# EAGLE design Shield_DMM (EAGLE 6.4)
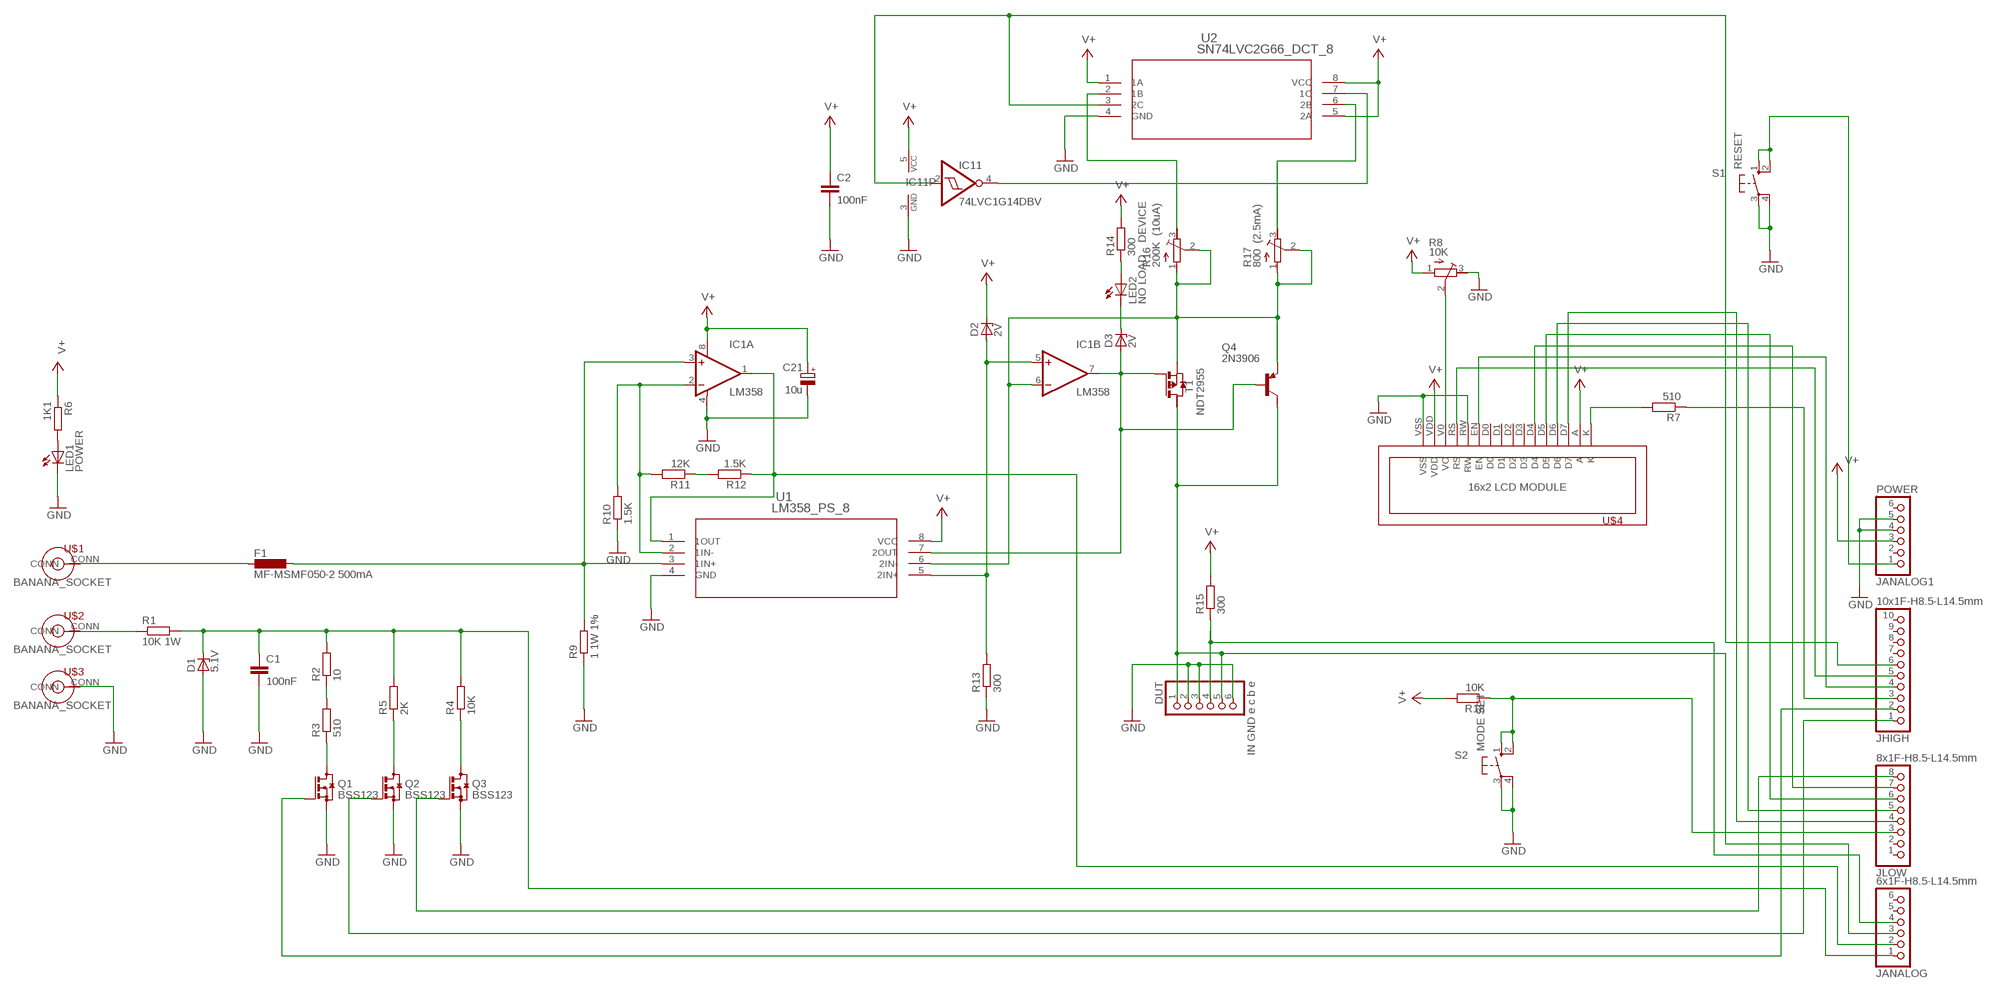
[diagram p0: schematic, sheet 1]

## Parts
C1  100nF  C-EUC0805  [C0805]
C2  100nF  C-EUC0805  [C0805]
C21  10u  CPOL-EU085CS-1AR  [085CS_1AR]
D1  5.1V  BZV10  [DO34Z7]
D2  2V  BZV10  [DO34Z7]
D3  2V  BZV10  [DO34Z7]
DUT  IN GND e c b e  PINHD-1X6  [1X06]
F1  MF-MSMF050-2 500mA  L-EUL1812  [L1812]
IC1  LM358  OPA2340U  [SO08]
IC11  74LVC1G14DBV  [SOT23-5]
JANALOG  6x1F-H8.5-L14.5mm  PINHD-1X6  [1X06]
JANALOG1  POWER  PINHD-1X6  [1X06]
JHIGH  10x1F-H8.5-L14.5mm  PINHD-1X10  [1X10]
JLOW  8x1F-H8.5-L14.5mm  PINHD-1X8  [1X08]
LED1  POWER  LEDCHIPLED_0805  [CHIPLED_0805]
LED2  NO LOAD DEVICE  LEDCHIPLED_0805  [CHIPLED_0805]
Q1  BSS123  [SOT23]
Q2  BSS123  [SOT23]
Q3  BSS123  [SOT23]
Q4  2N3906  [TO92]
R1  10K 1W  R-EU_0207/10  [0207/10]
R2  10  R-EU_R0805  [R0805]
R3  510  R-EU_R0805  [R0805]
R4  10K  R-EU_R0805  [R0805]
R5  2K  R-EU_R0805  [R0805]
R6  1K1  R-EU_R0805  [R0805]
R7  510  R-EU_R0805  [R0805]
R8  10K  R-TRIMM64W  [RTRIM64W]
R9  1 1W 1%  R-EU_0207/10  [0207/10]
R10  1.5K  R-EU_R0805  [R0805]
R11  12K  R-EU_R0805  [R0805]
R12  1.5K  R-EU_R0805  [R0805]
R13  300  R-EU_R0805  [R0805]
R14  300  R-EU_R0805  [R0805]
R15  300  R-EU_R0805  [R0805]
R16  200K (10uA)  R-TRIMM64W  [RTRIM64W]
R17  800 (2.5mA)  R-TRIMM64W  [RTRIM64W]
R18  10K  R-EU_R0805  [R0805]
S1  RESET  10-XX  [B3F-10XX]
S2  MODE SET  10-XX  [B3F-10XX]
T1  NDT2955  PMOSSOT223  [SOT223]
U1  LM358_PS_8  [PS8]
U2  SN74LVC2G66_DCT_8  [DCT8]
U$1  BANANA_CONN  [BANANA_CONN]
U$2  BANANA_CONN  [BANANA_CONN]
U$3  BANANA_CONN  [BANANA_CONN]
U$4  1602_LCM  [1602_LCM]

## Nets
GND: C1.2 C2.2 C21.- D1.A DUT.2 DUT.3 DUT.6 IC1.4(A:V-) IC11.3(GND) JANALOG1.4 JANALOG1.5 LED1.C Q1.2(S) Q2.2(S) Q3.2(S) R8.3(E) R9.1 R10.1 R13.1 S1.3(P) S1.4(P1) S2.3(P) S2.4(P1) U1.4(GND) U2.4(GND) U$3.CONN U$4.RW U$4.VSS
N$1: R1.1 U$2.CONN
N$2: C1.1 D1.C JANALOG.1 R1.2 R2.2 R4.2 R5.2
N$3: JHIGH.1 Q2.1(G)
N$4: Q3.3(D) R4.1
N$5: R2.1 R3.2
N$6: Q1.3(D) R3.1
N$7: JHIGH.2 Q1.1(G)
N$8: JLOW.8 Q3.1(G)
N$9: Q2.3(D) R5.1
N$10: LED1.A R6.2
N$11: R7.2 U$4.K
N$12: JHIGH.3 R7.1
N$13: R8.2(S) U$4.V0(VO)
N$14: JHIGH.4 U$4.EN
N$15: JHIGH.5 U$4.RS
N$16: JLOW.7 U$4.D4
N$17: JLOW.6 U$4.D5
N$18: JLOW.4 U$4.D7
N$19: JLOW.3 R18.1 S2.1(S) S2.2(S1)
N$20: F1.2 U$1.CONN
N$21: F1.1 IC1.3(A:+IN) R9.2 U1.3(1IN+)
N$22: IC1.2(A:-IN) R10.2 R11.2 U1.2(1IN-)
N$23: D2.A IC1.5(B:+IN) R13.2 U1.5(2IN+)
N$24: R11.1 R12.2
N$25: IC1.1(A:OUT) JANALOG.2 R12.1 U1.1(1OUT)
N$27: IC1.6(B:-IN) Q4.3(E) R16.1(A) R16.2(S) R17.1(A) R17.2(S) T1.3(S) U1.6(2IN-)
N$28: D3.C LED2.C
N$29: LED2.A R14.1
N$30: DUT.1 DUT.5 JANALOG.3 Q4.1(C) T1.2(D)
N$31: JANALOG1.1 S1.1(S) S1.2(S1)
N$32: DUT.4 JANALOG.4 R15.1
N$33: JLOW.5 U$4.D6
N$34: IC11.2(I) JHIGH.6 U2.3(2C)
N$35: R16.3(E) U2.2(1B)
N$36: IC11.4(O) U2.7(1C)
N$38: D3.A IC1.7(B:OUT) Q4.2(B) T1.1(G) U1.7(2OUT)
N$39: R17.3(E) U2.6(2B)
V+: C2.1 C21.+ D2.C IC1.8(A:V+) IC11.5(VCC) JANALOG1.3 R6.1 R8.1(A) R14.2 R15.2 R18.2 U1.8(VCC) U2.1(1A) U2.5(2A) U2.8(VCC) U$4.A U$4.VDD
Unconnected: JANALOG1.2 JANALOG1.6 JANALOG.5 JANALOG.6 JHIGH.7 JHIGH.8 JHIGH.9 JHIGH.10 JLOW.1 JLOW.2 T1.4(D2) U$4.D0 U$4.D1 U$4.D2 U$4.D3

## Library data of the parts
C1 C2 = rcl:C-EU: CAPACITOR, European symbol
C21 = rcl:CPOL-EU: POLARIZED CAPACITOR, European symbol
D1-D3 = diode:BZV10: Z DIODE
DUT JANALOG JANALOG1 = pinhead:PINHD-1X6: PIN HEADER
F1 = rcl:L-EU: INDUCTOR, European symbol
IC1 = burr-brown:OPA2340: Single-Supply, Rail-to-Rail Operational Amplifiers MicroAmplifier(TM) Series; Product Folder:OPA2340; MF: TEXAS INSTRUMENTS; MPN: OPA2340UA; OC_FARNELL: 1101541; OC_NEWARK: 36K7581
IC11 = 74xx-little-de:74*1G14: Single Schmitt-Trigger Inverter Gate
JHIGH = SmartPrj:PINHD-1X10: PIN HEADER
JLOW = SmartPrj:PINHD-1X8: PIN HEADER
LED1 LED2 = led:LED: LED OSRAM: - CHIPLED LG R971, LG N971, LY N971, LG Q971, LY Q971, LO R971, LY R971 LH N974, LH R974 LS Q976, LO Q976, LY Q976 LO Q996 - Hyper CHIPLED LW Q18S LB Q993, LB Q99A, LB R99A - SideLED LS A670, LO A670, LY A670, LG A670, LP A670 LB A673, LV A673, LT A673, LW A673 LH A674 LY A675 LS A676, LA A676, LO A676, LY A676, LW A676 LS A679, LY A679, LG A679 - Hyper Micro SIDELED® LS Y876, LA Y876, LO Y876, LY Y876 LT Y87S - SmartLED LW L88C, LW L88S LB L89C, LB L89S, LG L890 LS L89K, LO L89K, LY L89K LS L896, LA L896, LO L896, LY L896 - TOPLED LS T670, LO T670, LY T670, LG T670, LP T670 LSG T670, LSP T670, LSY T670, LOP T670, LYG T670 LG T671, LOG T671, LSG T671 LB T673, LV T673, LT T673, LW T673 LH T674 LS T676, LA T676, LO T676, LY T676, LB T676, LH T676, LSB T676, LW T676 LB T67C, LV T67C, LT T67C, LS T67K, LO T67K, LY T67K, LW E67C LS E67B, LA E67B, LO E67B, LY E67B, LB E67C, LV E67C, LT E67C LW T67C LS T679, LY T679, LG T679 LS T770, LO T770, LY T770, LG T770, LP T770 LB T773, LV T773, LT T773, LW T773 LH T774 LS E675, LA E675, LY E675, LS T675 LS T776, LA T776, LO T776, LY T776, LB T776 LHGB T686 LT T68C, LB T68C - Hyper Mini TOPLED® LB M676 - Mini TOPLED Santana® LG M470 LS M47K, LO M47K, LY M47K Source: http://www.osram.convergy.de LUXEON: - LUMILED® LXK2-PW12-R00, LXK2-PW12-S00, LXK2-PW14-U00, LXK2-PW14-V00 LXK2-PM12-R00, LXK2-PM12-S00, LXK2-PM14-U00 LXK2-PE12-Q00, LXK2-PE12-R00, LXK2-PE12-S00, LXK2-PE14-T00, LXK2-PE14-U00 LXK2-PB12-K00, LXK2-PB12-L00, LXK2-PB12-M00, LXK2-PB14-N00, LXK2-PB14-P00, LXK2-PB14-Q00 LXK2-PR12-L00, LXK2-PR12-M00, LXK2-PR14-Q00, LXK2-PR14-R00 LXK2-PD12-Q00, LXK2-PD12-R00, LXK2-PD12-S00 LXK2-PH12-R00, LXK2-PH12-S00 LXK2-PL12-P00, LXK2-PL12-Q00, LXK2-PL12-R00 Source: www.luxeon.com KINGBRIGHT: KA-3528ASYC Source: www.kingbright.com
Q1-Q3 = transistor-small-signal:BSS123: N-CHANNEL MOS FET
Q4 = transistor-pnp:2N3906: PNP Transistor
R1-R7 R9-R15 R18 = rcl:R-EU_: RESISTOR, European symbol
R8 R16 R17 = rcl:R-TRIMM: Trimm resistor
S1 S2 = switch-omron:10-XX: OMRON SWITCH
T1 = zetex:PMOSSOT223: MOS FET
U1 = LM358PS:LM358_PS_8; DATASHEETURL: http://www.ti.com/lit/gpn/LM358; DESCRIPTION: Dual Operational Amplifiers; FAMILY_NAME: STANDARD LINEAR AMPLIFIER; GENERIC_PART_NUMBER: LM358; INDUSTRY_STD_PKG_TYPE: SO; MANUFACTURER: Texas Instruments; PACKAGE_DESIGNATOR: PS; PIN_COUNT: 8
U2 = SN74LVC2G66_DCT_8:SN74LVC2G66_DCT_8; DATASHEETURL: http://www.ti.com/lit/gpn/SN74LVC2G66; DESCRIPTION: Dual Analog Switch; FAMILY_NAME: ANALOG SWITCH/MULTIPLEXER(less than or equal to 5V); GENERIC_PART_NUMBER: SN74LVC2G66; INDUSTRY_STD_PKG_TYPE: SM8; MANUFACTURER: Texas Instruments; MANUFACTURER_PART_NUMBER: sn74lvc2g66_dct_8; PACKAGE_DESIGNATOR: DCT; PIN_COUNT: 8; VENDOR: Texas Instruments
U$1-U$3 = banana-socket:BANANA_CONN: BANANA SOCKET 3.5 mm.
U$4 = 1602-LCM:1602_LCM

## Net classes
0 default: width 0.152 mm, drill 0.61 mm, clearance 0.152 mm
1 power: width 0.152 mm, drill 0.61 mm, clearance 0.152 mm
2 VIN: width 0.305 mm, drill 0.61 mm, clearance 0.152 mm
3 usbvcc: width 0.508 mm, drill 0.61 mm, clearance 0.254 mm

## Board
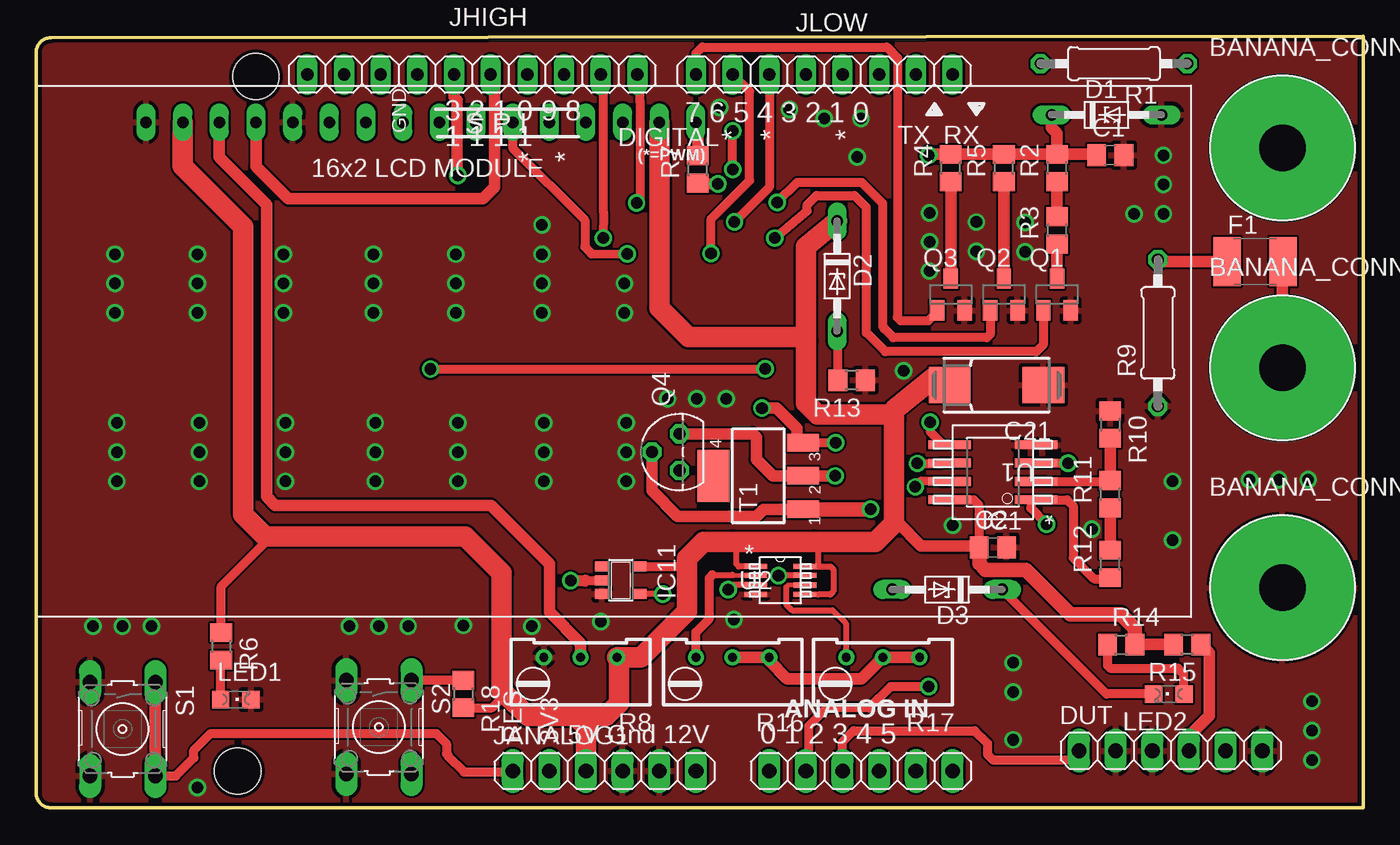
[diagram p1: board, top side]
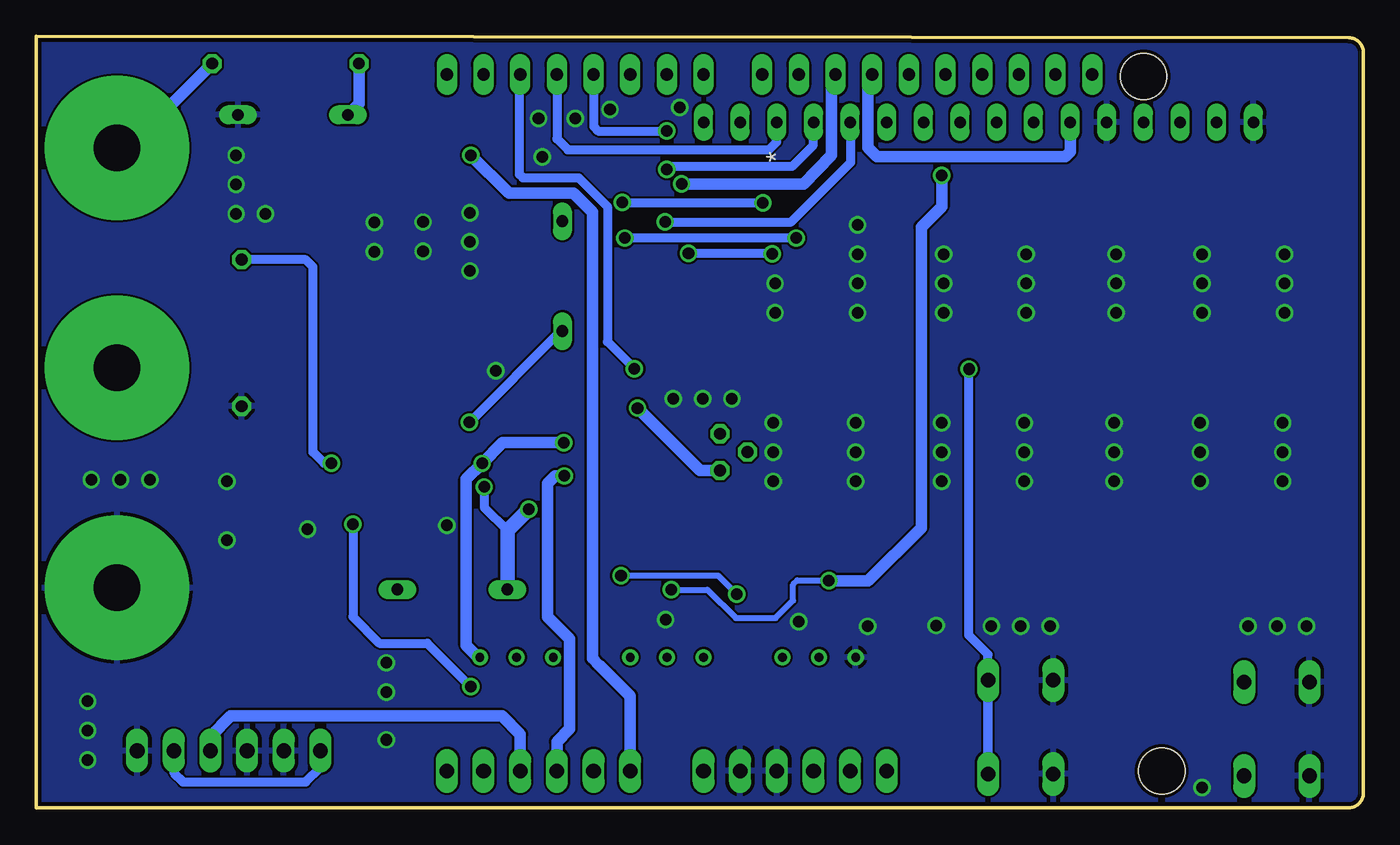
[diagram p2: board, bottom side, seen from below]

Size 91.96 x 53.48 mm. Coordinates in mm from the lower left corner, seen from the top.
Outline: 91.95,0 91.95,53.48 1,53.36 arc90 0,52.36 0,1.02 arc90 1,0.02 91.96,0.02
Copper layers (1*16): Top 0.035mm / dielectric 1.5mm / Bottom 0.035mm
Design rules "ITEADstudio_DRC": minimum track width 6mil, minimum drill 12mil, track to track 6mil, track to pad 6mil, pad to pad 6mil, via to via 6mil, smd to smd 0mil, copper to edge 10mil, drill to drill 10mil, minimum pad ring 10mil, minimum via ring 6mil, stop-mask expansion 2mil, vias tented up to drill 100mil, thermal gap 10mil
Holes 3.2 mm at 15.24,50.69 13.97,2.56

### Footprints (pad centres in the part's own frame; a part is rotated, then mirrored left to right if it is on the bottom)
C0805 = smd 1.3 x 1.5: 1 -0.95,0; 2 0.95,0
085CS_1AR = smd 2.9 x 2.5: + 3.25,0; - -3.25,0
DO34Z7 = drill 0.813 long: A 3.81,0; C -3.81,0
1X06 = drill 1.016 long: 1 -6.35,0; 2 -3.81,0; 3 -1.27,0; 4 1.27,0; 5 3.81,0; 6 6.35,0
L1812 = smd 1.9 x 3.4: 1 -1.95,0; 2 1.95,0
SO08 = smd 0.61 x 2.21: 1 -1.905,-2.616; 2 -0.635,-2.616; 3 0.635,-2.616; 4 1.905,-2.616; 5 1.905,2.616; 6 0.635,2.616; 7 -0.635,2.616; 8 -1.905,2.616
SOT23-5 = smd 0.69 x 0.99: 1 -0.95,-1.29; 2 0,-1.29; 3 0.95,-1.29; 4 0.95,1.3; 5 -0.95,1.3
1X10 = drill 0.85 pad 1.422 long: 1 -11.43,0; 2 -8.89,0; 3 -6.35,0; 4 -3.81,0; 5 -1.27,0; 6 1.27,0; 7 3.81,0; 8 6.35,0; 9 8.89,0; 10 11.43,0
1X08 = drill 0.85 pad 1.422 long: 1 -8.89,0; 2 -6.35,0; 3 -3.81,0; 4 -1.27,0; 5 1.27,0; 6 3.81,0; 7 6.35,0; 8 8.89,0
CHIPLED_0805 = smd 1.2 x 1.2: A 0,-1.05; C 0,1.05
SOT23 = smd 1 x 1.4: 1 -0.95,-1.1; 2 0.95,-1.1; 3 0,1.1
TO92 = drill 0.813 octagon: 1 1.27,0; 2 0,1.905; 3 -1.27,0
0207/10 = drill 0.813 octagon: 1 -5.08,0; 2 5.08,0
R0805 = smd 1.3 x 1.5: 1 -0.95,0; 2 0.95,0
RTRIM64W = drill 0.61: 1 1.27,-2.54; 2 1.27,0; 3 1.27,2.54
B3F-10XX = drill 1.016 long: 1 -3.251,2.261; 2 3.251,2.261; 3 -3.251,-2.261; 4 3.251,-2.261
SOT223 = smd 1.219 x 2.235: 1 -2.311,-3.099; 2 0,-3.099; 3 2.311,-3.099 | smd 3.6 x 2.2: 4 0,3.099
PS8 = smd 2.057 x 0.559: 1 -3.429,1.905; 2 -3.429,0.635; 3 -3.429,-0.635; 4 -3.429,-1.905; 5 3.429,-1.905; 6 3.429,-0.635; 7 3.429,0.635; 8 3.429,1.905
DCT8 = smd 1.575 x 0.356: 1 -1.702,0.965; 2 -1.702,0.33; 3 -1.702,-0.33; 4 -1.702,-0.965; 5 1.702,-0.965; 6 1.702,-0.33; 7 1.702,0.33; 8 1.702,0.965
BANANA_CONN = drill 3.2 pad 10: CONN 0,0
1602_LCM = drill 0.8 long: A 43.18,34.29; D0 22.86,34.29; D1 25.4,34.29; D2 27.94,34.29; D3 30.48,34.29; D4 33.02,34.29; D5 35.56,34.29; D6 38.1,34.29; D7 40.64,34.29; EN 20.32,34.29; K 45.72,34.29; RS 15.24,34.29; RW 17.78,34.29; V0 12.7,34.29; VDD 10.16,34.29; VSS 7.62,34.29

### Placement (x,y rotation side)
C1  74.42,45.23 0 top
C2  66.29,18.05 0 top
C21  66.55,29.29 180 top
D1  74.17,48.02 0 top
D2  55.5,36.85 270 top
D3  63.12,15.13 180 top
DUT  78.61,3.95 0 top
F1  84.45,37.86 0 top
IC1  66.29,23.26 90 top
IC11  40.51,15.76 270 top
JANALOG  57.15,2.56 0 top
JANALOG1  39.37,2.56 0 top
JHIGH  30.23,50.82 180 top
JLOW  54.61,50.82 180 top
LED1  13.84,7.51 270 top
LED2  78.49,7.89 90 top
Q1  70.74,35.58 0 top
Q2  67.06,35.58 0 top
Q3  63.37,35.58 0 top
Q4  44.58,24.65 90 top
R1  74.68,51.58 180 top
R2  70.74,44.34 90 top
R3  70.74,40.02 90 top
R4  63.37,44.34 90 top
R5  67.06,44.34 90 top
R6  12.83,11.19 270 top
R7  45.85,44.24 90 top
R8  37.72,9.17 90 top
R9  77.72,32.91 90 top
R10  74.42,26.56 270 top
R11  74.42,21.73 90 top
R12  74.42,16.91 90 top
R13  56.52,29.63 180 top
R14  75.18,11.32 0 top
R15  79.76,11.32 180 top
R16  48.26,9.17 90 top
R17  58.67,9.17 90 top
R18  29.59,7.89 270 top
S1  6,5.47 270 top
S2  23.75,5.59 270 top
T1  50.04,23 90 top
U1  66.29,23.26 180 top
U2  51.56,15.76 0 top
U$1  86.36,30.5 0 top
U$2  86.36,45.74 0 top
U$3  86.36,15.26 0 top
U$4  0,13.22 0 top

### Tracks (layer width: path | path; a pad name or v marks a point on that pad's centre or on a via)
GND  (via drill 0.8)
  Top 0.305: IC1.4 U1.4
  other vias: 78.11,43.2 78.11,41.16 76.07,41.16 78.11,45.23 61.91,39.22 61.9,37.2 61.9,41.24 40.77,36.34 40.77,34.31 35.05,40.4 40.89,24.65 40.89,22.62 40.89,26.69 35.05,36.34 35.05,34.31 35.05,38.37 35.18,24.65 35.18,22.62 35.18,26.69 29.08,36.34 29.08,34.31 29.08,38.37 29.21,24.65 29.21,22.62 29.21,26.69 23.37,36.34 23.37,34.31 23.37,38.37 23.5,24.65 23.5,22.62 23.5,26.69 17.14,36.34 17.14,34.31 17.14,38.37 17.27,24.65 17.27,22.62 17.27,26.69 11.18,36.34 11.18,34.31 11.18,38.37 11.3,24.65 11.3,22.62 11.3,26.69 5.46,36.34 5.46,34.31 5.46,38.37 5.59,24.65 5.59,22.62 5.59,26.69 67.69,8.02 67.69,4.71 67.69,10.05 73.15,19.32 78.74,18.56 78.74,22.62 88.39,5.35 88.39,3.32 88.39,7.38 86.11,22.75 88.14,22.75 84.07,22.75 45.78,28.34 43.75,28.34 47.82,28.34 5.97,12.59 8,12.59 3.94,12.59 23.75,12.59 25.78,12.59 21.72,12.59 48.35,13.05 39.12,12.89 68.52,38.54 68.52,40.57 65.15,38.56 65.15,40.59 29.59,12.64 34.35,12.58 60.12,30.28 54.61,47.77 52.2,48.4 47.37,48.53 56.9,45.1 57.15,47.77 11.18,1.41 63.5,19.57
  pour Bottom: -1.27,54.63 93.98,54.63 93.98,-1.25 -1.27,-1.25
  pour Top: -2.54,55.9 95.25,55.9 95.25,-2.52 -2.54,-2.52
N$1
  Bottom 0.813: U$2.CONN 85.6,45.74 R1.1
N$2  (via drill 0.8)
  Top 0.813: D1.C 70.36,47.13 70.74,46.75 R2.2 | R2.2 73.41,45.29 C1.1 | R2.2 R5.2 R4.2 61.91,45.29 v61.85,45.23
  Bottom 0.813: R1.2 69.6,48.78 D1.C | JANALOG.1 50.8,7.76 52.2,9.16 52.21,9.16 52.93,9.88 52.95,9.88 53.42,10.35 53.42,41.28 54.72,42.59 59.21,42.59 v61.85,45.23
N$3  (via drill 0.8)
  Top 0.61: Q2.1 66.11,32.82 65.86,32.58 59.4,32.58 58.78,33.2 58.78,33.25 58.66,33.37 58.66,41.89 57.21,43.34 52.72,43.34 v51.35,41.96 | JHIGH.1 41.82,50.51 41.82,48.96 41.86,48.92 41.86,42.17 v41.6,41.91
  Bottom 0.61: 41.77,41.95 v41.6,41.91 41.76,41.95 51.13,41.95 v51.35,41.96
N$4
  Top 0.813: R4.1 Q3.3
N$5
  Top 0.813: R2.1 R3.2
N$6
  Top 0.813: R3.1 Q1.3
N$7  (via drill 0.8)
  Top 0.61: Q1.1 69.79,32.1 69.3,31.61 58.84,31.61 57.53,32.92 57.53,41.6 56.69,42.43 54.08,42.43 53.42,41.77 53.42,41.37 v51.18,39.49 | JHIGH.2 39.31,50.62 39.31,41.33 v39.29,39.49
  Bottom 0.61: v39.29,39.49 v51.18,39.49
N$8
  Top 0.61: Q3.1 62.42,34.36 61.8,33.73 59.92,33.73 59.65,34 59.69,34.04 59.69,51.96 58.94,52.72 46.15,52.72 45.72,52.29 JLOW.8
N$9
  Top 0.813: R5.1 Q2.3
N$10
  Top 0.61: LED1.A 12.79,10.21 R6.2
N$11
  Top 0.813: R7.2 45.85,47.39 U$4.K
N$12  (via drill 0.8)
  Top 0.813: R7.1 47.2,43.22 v47.24,43.23
  Bottom 0.813: v47.24,43.23 38.81,43.23 36.84,45.23 36.84,50.55 JHIGH.3
N$13
  Top 0.813: R8.2 37.72,11.41 35.56,13.57 35.56,16.92 31.51,20.97 16.56,20.97 15.96,21.57 15.96,41.81 12.7,45.08 U$4.V0
N$14
  Bottom 0.813: U$4.EN 20.32,45.46 20.64,45.14 33.72,45.14 34.31,45.74 34.31,50.54 JHIGH.4
N$15
  Top 0.813: U$4.RS 15.24,44.44 17.48,42.2 30.96,42.2 31.76,43.02 31.75,50.45 JHIGH.5
N$16  (via drill 0.8)
  Top 0.61: U$4.D4 33.02,45.72 38.02,40.72 38.02,38.88 38.47,38.38 v40.96,38.39 | v46.76,38.42 46.76,40.81 49.43,43.48 49.43,49.65 JLOW.7
  Bottom 0.61: v40.96,38.39 46.74,38.39 v46.76,38.42
N$17  (via drill 0.8)
  Top 0.61: JLOW.6 50.8,43.02 v48.39,40.6
  Bottom 0.61: v48.39,40.6 39.65,40.6 35.52,44.73 35.52,47.48 U$4.D5
N$18
  Bottom 0.61: JLOW.4 55.88,46.36 55.12,45.6 41.2,45.6 40.65,46.14 40.65,47.5 U$4.D7
N$19  (via drill 0.8)
  Top 0.61: R18.1 S2.1 | v27.33,30.41 50.48,30.41 v50.51,30.43
  Bottom 0.61: S2.1 S2.2 26.01,10.63 27.34,11.97 27.34,30.39 v27.33,30.41 | JLOW.3 58.47,50.77 58.47,43.91 58.23,43.67 54.37,43.67 52.38,41.67 52.38,32.3 v50.51,30.43
N$20
  Top 0.813: U$1.CONN 86.36,37.99 86.74,38.37 86.74,38.2 F1.2
N$21  (via drill 0.8)
  Top 0.61: IC1.3 U1.3 v71.5,23.89
  Top 0.813: F1.1 77.85,37.86 R9.2
  Bottom 0.61: v71.5,23.89 72.01,23.89 72.77,24.65 72.77,37.48 73.28,37.99 R9.2
N$22
  Top 0.305: IC1.2 U1.2
  Top 0.61: U1.2 74.36,22.62 R11.2
  Top 0.813: R11.2 R10.2
N$23  (via drill 0.8)
  Top 0.305: IC1.5 U1.5
  Top 0.61: v61.94,26.71 61.94,26.09 U1.5 | R13.2 55.56,32.97 D2.A
  Bottom 0.61: D2.A 55.65,33.04 55.65,33 v61.94,26.71
N$24
  Top 0.813: R12.2 R11.1
N$25  (via drill 0.8)
  Top 0.305: IC1.1 U1.1
  Top 0.61: U1.1 71.42,21.35 71.86,20.92 71.86,17.33 73.3,15.88 74.34,15.88 R12.1 | IC1.1 68.91,20.77 v70.02,19.66 | v61.85,8.4 59.2,8.4 57.72,6.92 54.8,6.92 53.53,5.66 53.53,2.75 JANALOG.2
  Bottom 0.61: v70.02,19.66 70.02,13.24 68.19,11.41 64.86,11.41 v61.85,8.4
N$27  (via drill 0.8)
  Top 0.305: IC1.6 U1.6
  Top 0.61: T1.3 55.4,25.31 v55.41,25.3 | v61.06,23.87 62.84,23.87 U1.6
  Top 0.813: R16.2 R16.1 50.8,10.18 52.03,8.94 57.18,8.94 R17.2 R17.1 | v50.29,27.7 51.31,27.7 52.7,26.3 52.7,25.75 T1.3
  Bottom 0.813: R17.1 61.33,10.44 62.17,11.27 62.17,22.77 v61.06,23.87 59.63,25.3 v55.41,25.3 | Q4.3 45.97,23.38 v50.29,27.7
N$28
  Top 0.61: LED2.C 74.17,7.89 D3.C
N$29
  Top 0.61: R14.1 74.23,9.86 74.42,9.67 79.12,9.67 79.5,9.29 79.5,7.92 LED2.A
N$30  (via drill 0.8)
  Top 0.61: JANALOG.3 55.88,4.59 56.64,5.35 65.02,5.35 65.91,4.46 65.91,3.7 66.29,3.32 71.63,3.32 DUT.1
  Top 0.813: v55.37,23 T1.2 51.05,23 49.91,24.15 49.91,25.67 49.66,25.92 Q4.1
  Bottom 0.61: DUT.5 82.42,2.43 81.79,1.79 73.28,1.79 72.26,2.81 DUT.1
  Bottom 0.813: v55.37,23 56.01,23 56.52,22.49 56.52,13.22 54.99,11.7 54.99,5.48 55.88,4.59 JANALOG.3
N$31
  Top 0.61: S1.2 9.68,2.21 10.92,3.46 10.92,3.98 12.1,5.16 27.72,5.16 28.43,4.45 28.43,3.76 28.51,3.69 28.51,3.61 29.64,2.48 32.94,2.48 JANALOG1.1
  Top 0.813: S1.1 S1.2
N$32
  Top 0.813: DUT.4 79.88,4.97 81.28,6.37 81.28,10.74 R15.1
  Bottom 0.813: JANALOG.4 58.42,5.1 59.69,6.37 78.49,6.37 79.88,4.97 DUT.4
N$33  (via drill 0.8)
  Top 0.61: v48.26,44.25 v48.26,46.9
  Bottom 0.61: JLOW.5 53.34,47.22 53.02,46.9 v48.26,46.9 | U$4.D6 38.11,47.5 38.11,45.93 39.6,44.44 48.07,44.44 v48.26,44.25
N$34  (via drill 0.8)
  Top 0.406: U2.3 48.27,15.43 v47.95,15.12
  Top 0.61: 38.06,15.75 39.21,15.75 IC11.2
  Top 0.813: JHIGH.6 28.96,49.27 29.17,49.05 29.17,43.86 v29.21,43.82 | v37.03,15.75 38.05,15.74 38.06,15.75
  Bottom 0.406: v47.95,15.12 45.45,15.12 43.48,13.15 40.73,13.15 39.51,14.37 39.51,15.48 IC11.2 37.05,15.76 v37.03,15.75
  Bottom 0.813: v29.21,43.82 29.21,41.67 30.63,40.25 30.63,19.41 34.31,15.73 36.56,15.73 v37.03,15.75
N$35
  Top 0.305: 48.27,16.11 49.28,16.11 49.31,16.07 49.84,16.07 U2.2
  Top 0.406: 46.86,16.14 48.23,16.14 48.27,16.11
  Top 0.61: R16.3 45.72,12.17 46.65,13.1 46.65,15.93 46.86,16.14
N$36  (via drill 0.8)
  Top 0.406: U2.7 v51.44,16.09 | v43.42,14.81 IC11.4
  Bottom 0.406: v51.44,16.09 44.7,16.09 v43.42,14.81
N$38  (via drill 0.8)
  Top 0.305: U1.7 IC1.7
  Top 0.61: U1.7 61.32,22.63 v60.92,22.24
  Top 0.813: T1.1 50.39,20.69 49.91,20.21 44.45,20.21 42.67,21.99 Q4.2
  Top 1.016: v57.84,20.69 T1.1
  Bottom 0.61: v60.92,22.24 60.92,20.82 59.31,19.22
  Bottom 1.016: D3.A 59.31,19.22 v57.84,20.69
N$39
  Top 0.305: U2.6 52.11,15.43 51.96,15.28
  Top 0.406: 51.96,15.28 51.96,14.11 52.38,13.69 55.17,13.69 56.1,12.77 56.1,10.47 R17.3
V+
  Top 0.305: 54.2,14.79 53.28,14.79 U2.5 | U2.8 54.18,16.73 54.22,16.77 | 62.22,29.84 62.17,29.62 59.45,26.9
  Top 0.406: U2.1 48.69,16.73 48.51,16.91 48.51,18.18 48.26,18.43 | U2.8 55.04,16.73 55.24,16.53 55.24,15 55.07,14.82 55.05,14.82 55.02,14.79 54.2,14.79 | 54.22,16.77 54.22,18.15 53.94,18.43
  Top 0.61: IC11.5 44.89,16.71 45.09,16.91 | U1.8 IC1.8 64.96,21.35 65.32,21 65.32,18.08 C2.1 | R18.2 31.6,6.94 32.53,7.87 | R6.1 12.83,15.35 16.29,18.81
  Top 0.813: R15.2 R14.2 | 59.44,19.7 59.77,19.7 61.32,18.15 65.24,18.15 C2.1
  Top 1.016: R14.2 76.13,12.44 75.16,13.41 71.65,13.41 68.57,16.5 65.79,16.5 65.34,16.94 C2.1
  Top 1.422: C21.+ 62.61,29.86 62.22,29.84 59.44,27.57 59.44,19.7 58.17,18.43 53.94,18.43 48.26,18.43 46.23,18.43 45.09,17.29 45.09,16.91 45.09,13.61 41.92,10.44 R8.1 40.39,10.31 40.39,7.25 39.5,6.37 37.34,6.37 | D2.C 53.35,38.89 53.35,32.36 | JANALOG1.3 38.1,5.6 37.34,6.37 | 37.34,6.37 34.04,6.37 32.53,7.87 32.26,8.14 32.26,16.27 29.72,18.81 16.29,18.81 15.88,18.81 14.35,20.34 14.35,40.27 10.16,44.47 U$4.VDD | 59.45,26.9 59.45,26.91 59.11,27.26 54.14,27.26 53.35,28.04 53.35,32.36 | U$4.A 43.18,34.65 45.21,32.62 53.1,32.62 53.35,32.36

### Text on the board
tPlace: S P I | DIGITAL
tNames: 3 2 1 0 9 8 | GND | 7 6 5 4 3 2 1 0 | 1 1 1 1 | * | * | * | TX | RX | * | * | (*=PWM) | ANALOG IN | RES | 3V3 | 5V Gnd 12V | 0 1 2 3 4 5
bNames: *